# Altium project m1.PrjPcb
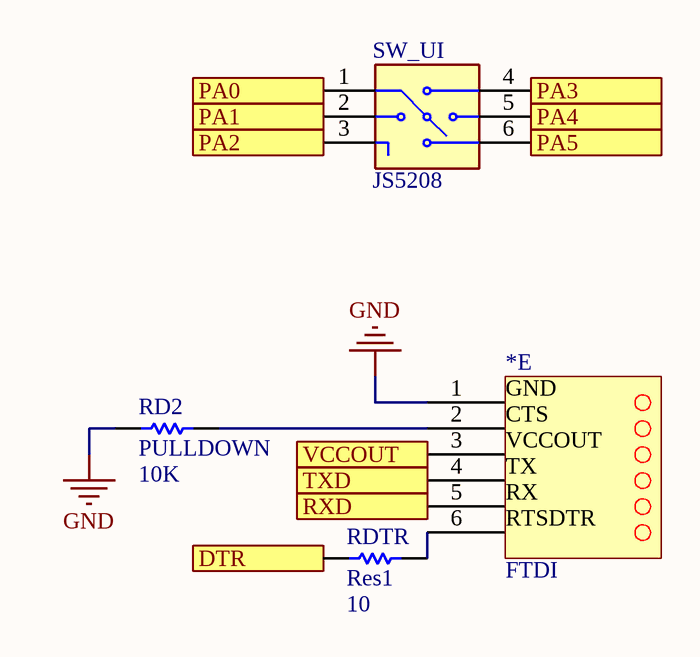
[diagram p0: Input.SchDoc]
2 sheets, 11 parts. Net scope: flat (ports and power ports of the same name join across sheets).
Sheets:
  Input.SchDoc
  Output.SchDoc

## Sheet Input.SchDoc
size A4; SheetNumber: 2; SheetTotal: 3

### Parts
*  FTDI  (part E of 5)
RD2  PULLDOWN  value 10K  [AXIAL-0.1-RES]
RDTR  Res1  value 10  [AXIAL-0.1-RES]
SW_UI  JS5208  [SW_JS5208]

### Ports
DTR (out), PA0 (out), PA1 (out), PA2 (out), PA3 (out), PA4 (out), PA5 (out), RXD (in), TXD (out), VCCOUT (in)

### Nets
GND: RD2.1
NetRDTR_1: RDTR.1 ; port DTR
NetSW_UI_1: SW_UI.1 ; port PA0
NetSW_UI_2: SW_UI.2 ; port PA1
NetSW_UI_3: SW_UI.3 ; port PA2
NetSW_UI_4: SW_UI.4 ; port PA3
NetSW_UI_5: SW_UI.5 ; port PA4
NetSW_UI_6: SW_UI.6 ; port PA5

Not connected (* = marked no-connect by the designer): * 1 2 3 4 5 6; RD2 2; RDTR 2

### Notes on the sheet
- (in symbol Component_1, part E) GND; CTS; VCCOUT; TX; RX; RTSDTR

### Library data of the parts
* = Component_1
RD2 = RES 10K OHM 5% 1/4W AXIAL: Resistor; Manufacturer Part Number: CFR-25JB-52-10K; Designator: R?; Power Rating: 1/4W; Tolerance: 0.05; Published: 8-Jun-2000; LatestRevisionDate: 17-Jul-2002; LatestRevisionNote: Re-released for DXP Platform.; Publisher: Altium Limited
RDTR = RES 10 OHM 5% 1/4W AXIAL: Resistor; Manufacturer Part Number: CFR-25JB-52-10R; Designator: R?; Power Rating: 1/4W; Tolerance: 0.05; Published: 8-Jun-2000; LatestRevisionDate: 17-Jul-2002; LatestRevisionNote: Re-released for DXP Platform.; Publisher: Altium Limited
SW_UI = JS5208: MP: JS5208; Availability: Unavailable; Package: None; Price: None; Value: *

## Sheet Output.SchDoc
size A4; SheetNumber: 3; SheetTotal: 3
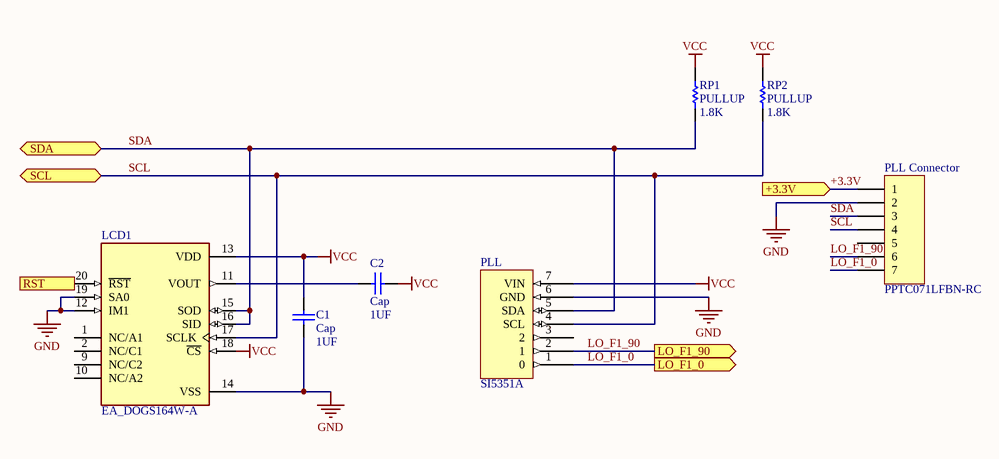
[diagram p1: Output.SchDoc]

### Parts
C1  Cap  value 1UF  [RADIAL-0.1]
C2  Cap  value 1UF  [RADIAL-0.1]
LCD1  EA_DOGS164W-A  [LCD_EA_DOGS164W-A]
PLL  SI5351A
PLL_Connector  PPTC071LFBN-RC  [HDR1X7]
RP1  PULLUP  value 1.8K  [AXIAL-0.1-RES]
RP2  PULLUP  value 1.8K  [AXIAL-0.1-RES]

### Ports
+3.3V (in), LO_F1_0 (out), LO_F1_90 (out), RST (in), SCL (bidir), SDA (bidir)

### Nets
GND: C1.1 LCD1.12(IM1) LCD1.14(VSS) LCD1.19(SA0) PLL.6(GND) PLL_Connector.2
VCC: C1.2 C2.1 LCD1.13(VDD) LCD1.18(~{CS}) PLL.7(VIN) RP1.2 RP2.2
+3.3V: PLL_Connector.1 ; port +3.3V
LO_F1_0: PLL.1(0) PLL_Connector.7 ; port LO_F1_0
LO_F1_90: PLL.2(1) PLL_Connector.6 ; port LO_F1_90
SCL: LCD1.17(SCLK) PLL.4(SCL) PLL_Connector.4 RP2.1 ; port SCL
SDA: LCD1.15(SOD) LCD1.16(SID) PLL.5(SDA) PLL_Connector.3 RP1.1 ; port SDA
NetC2_2: C2.2 LCD1.11(VOUT)
NetLCD1_20: LCD1.20(~{RST}) ; port RST

Not connected (* = marked no-connect by the designer): LCD1 1(NC/A1) 2(NC/C1) 9(NC/C2) 10(NC/A2); PLL 3(2); PLL_Connector 5

### Library data of the parts
C1 C2 = CAP ALUM 1UF 20% 100V RADIAL: Capacitor; Manufacturer Part Number: ESE105M100AC3EA; Designator: C?; Voltage Rating: 100V; Published: 8-Jun-2000; LatestRevisionDate: 17-Jul-2002; LatestRevisionNote: Re-released for DXP Platform.; Publisher: Altium Limited
LCD1 = EA_DOGS164W-A: Character LCD Display Module Transflective 5 x 32 Dots FSTN - Film Super-Twisted Nematic Without Backlight IÂ²C, SPI 40.00mm x 33.00mm x 2.60mm; MF: Display Visions; MP: EA DOGS164W-A; Value: *; Check_prices: https://www.snapeda.com/parts/EA%20DOGS164W-A/Focus+Display+Solutions/view-part/?ref=eda; Price: None; SnapEDA_Link: https://www.snapeda.com/parts/EA%20DOGS164W-A/Focus+Display+Solutions/view-part/?ref=snap; Purchase-URL: https://pricing.snapeda.com/search/part/EA DOGS164W-A/?ref=eda; Package: None; Availability: In Stock
PLL_Connector = Header 7: Header, 7-Pin; LatestRevisionDate: 17-Jul-2002; LatestRevisionNote: Re-released for DXP Platform.; Publisher: Altium Limited
RP1 RP2 = RES 1.8K OHM 5% 1/4W AXIAL: Resistor; Manufacturer Part Number: CFR-25JB-52-1K8; Designator: R?; Power Rating: 1/4W; Tolerance: 0.05; Published: 8-Jun-2000; LatestRevisionDate: 17-Jul-2002; LatestRevisionNote: Re-released for DXP Platform.; Publisher: Altium Limited

## Nets that join several sheets
GND: Input (RD2.1), Output (6 pins)